# Altium schematic sheet remora-2-sensors.SchDoc
size Legal
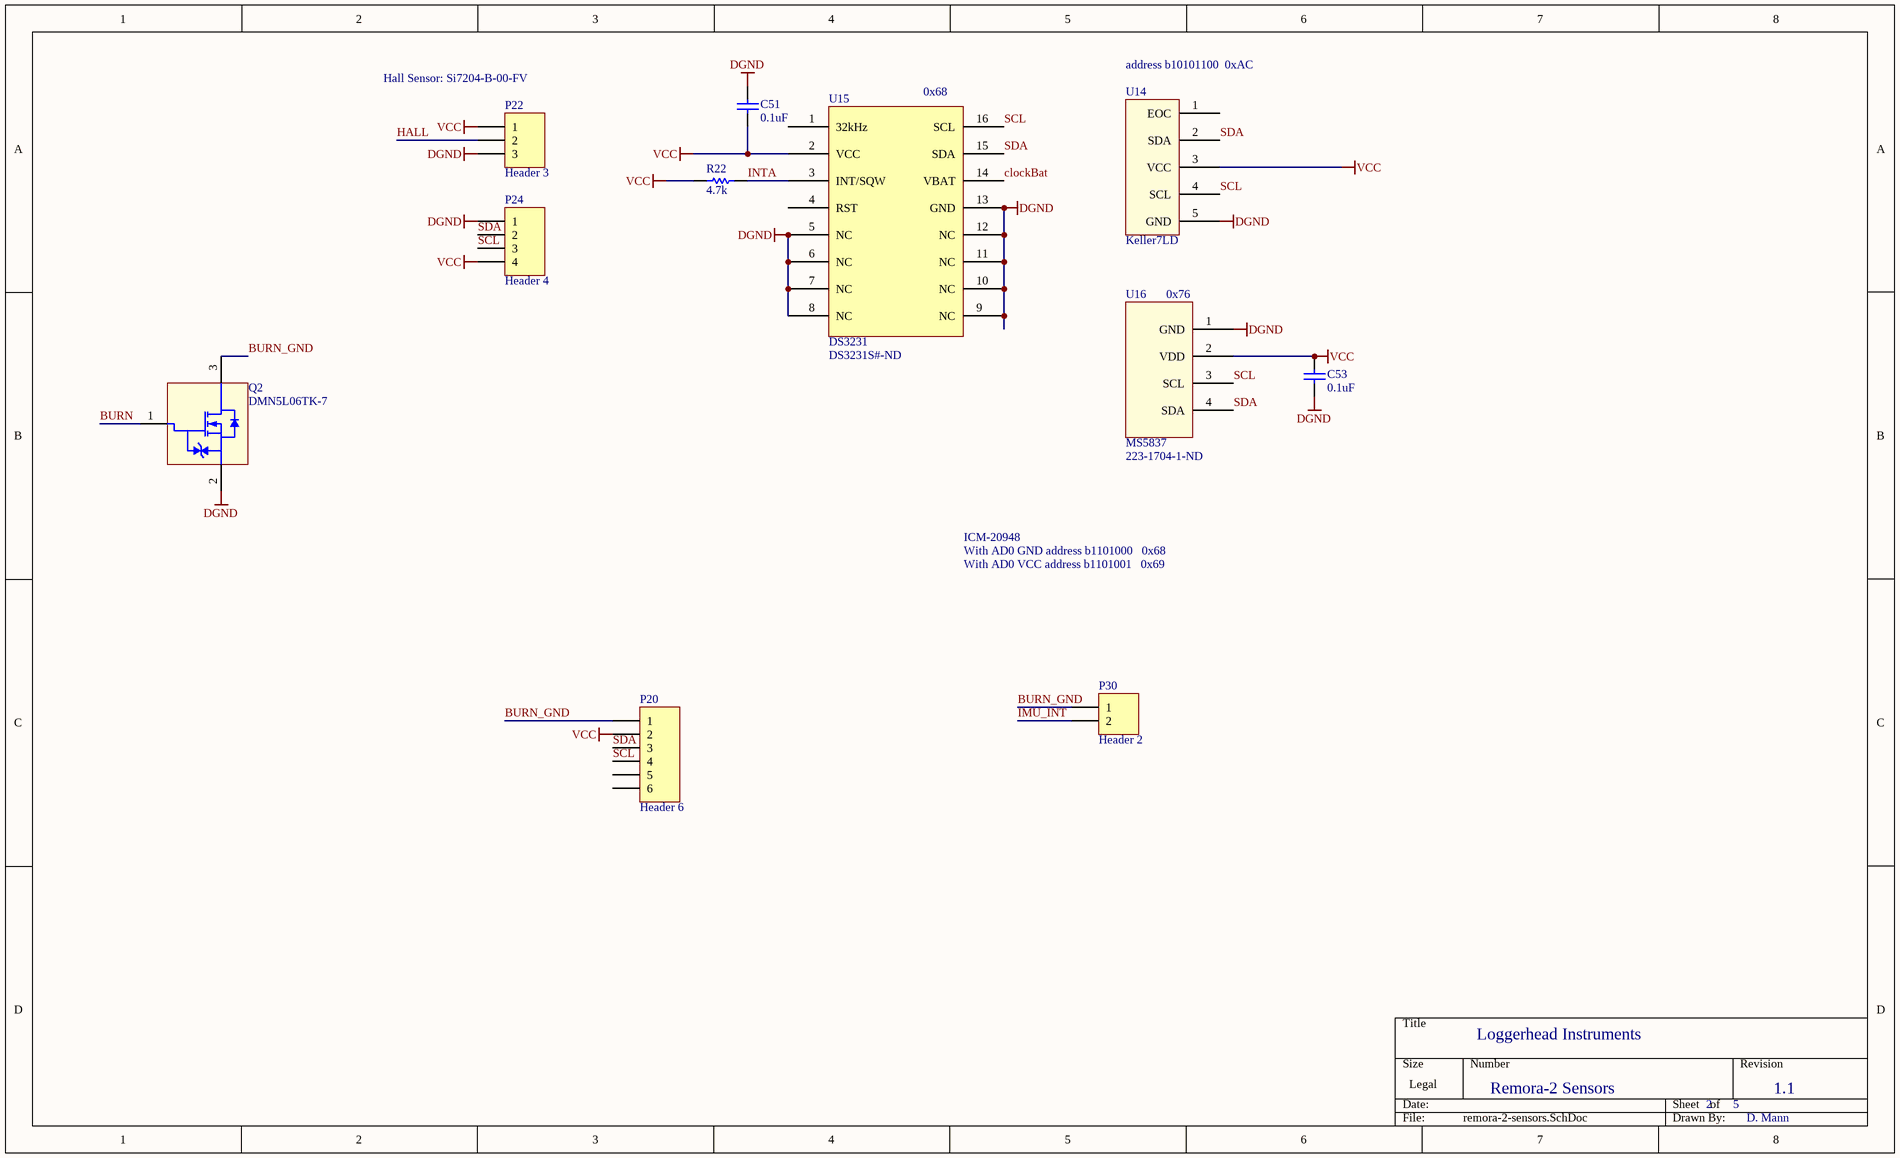
[diagram p0: remora-2-sensors.SchDoc]

## Parts
C51  0.1uF  [0402]
C53  0.1uF  [0402]
P20  Header 6  [HDR1X6]
P22  Header 3  [HDR1X3]
P24  Header 4  [HDR1X4]
P30  Header 2  [HDR1X2]
Q2  DMN5L06TK-7  [SOT-523]
R22  4.7k  [3-0603]
U14  Keller7LD  [Keller7LD]
U15  DS3231  Supplier Part Number 1: DS3231S#-ND  [DS3231]
U16  MS5837  Supplier Part Number 1: 223-1704-1-ND  [MS5837]

## Nets
DGND: C51.1 C53.1 P22.3 P24.1 Q2.2(S) U14.5(GND) U15.5(NC) U15.6(NC) U15.7(NC) U15.8(NC) U15.9(NC) U15.10(NC) U15.11(NC) U15.12(NC) U15.13(GND) U16.1(GND)
VCC: C51.2 C53.2 P20.2 P22.1 P24.4 R22.1 U14.3(VCC) U15.2(VCC) U16.2(VDD)
BURN: Q2.1(G)
BURN_GND: P20.1 P30.1 Q2.3(D)
clockBat: U15.14(VBAT)
HALL: P22.2
IMU_INT: P30.2
INTA: R22.2 U15.3(INT/SQW)
SCL: P20.4 P24.3 U14.4(SCL) U15.16(SCL) U16.3(SCL)
SDA: P20.3 P24.2 U14.2(SDA) U15.15(SDA) U16.4(SDA)

Not connected (* = marked no-connect by the designer): P20 5 6; U14 1(EOC); U15 1(32kHz) 4(RST)

## Notes on the sheet
- (near P22) Hall Sensor: Si7204-B-00-FV
- (near U15) 0x68
- (near U14) address b10101100  0xAC
- (near U16) 0x76
- With AD0 GND address b1101000   0x68
- With AD0 VCC address b1101001   0x69
- ICM-20948
- Loggerhead Instruments
- Remora-2 Sensors
- 2
- 5
- 1.1
- D. Mann

## Library data of the parts
C51 = C0402: Ceramic Chip Capacitor - Standard; Note: Footprint corresponds to dimensions for bulk cassette packaging. This case size has tightened tolerances.; Value: 10nF; Published: 17-Jul-2002; LatestRevisionDate: 19-Mar-2004; LatestRevisionNote: Silkscreen size reduced.; DatasheetDocument: Mar-2001; PackageDocument: Mar-2001; PackageReference: 0402; Publisher: Altium Limited; Code_JEITA: 0402; Code_IPC: 1005 [0402]; ComponentLink1Description: Manufacturer Link; ComponentLink1URL: http://www.kemet.com/; ComponentLink2Description: Datasheet; ComponentLink2URL: http://www.kemet.com/kemet/web/homepage/kechome.nsf/vapubfilesname/F3102TA.pdf/$file/F3102TA.pdf
C53 = C0402: Ceramic Chip Capacitor - Standard; Note: Footprint corresponds to dimensions for bulk cassette packaging. This case size has tightened tolerances.; Published: 17-Jul-2002; LatestRevisionDate: 19-Mar-2004; LatestRevisionNote: Silkscreen size reduced.; DatasheetDocument: Mar-2001; PackageDocument: Mar-2001; PackageReference: 0402; Publisher: Altium Limited; Code_JEITA: 0402; Code_IPC: 1005 [0402]; ComponentLink1Description: Manufacturer Link; ComponentLink1URL: http://www.kemet.com/; ComponentLink2Description: Datasheet; ComponentLink2URL: http://www.kemet.com/kemet/web/homepage/kechome.nsf/vapubfilesname/F3102TA.pdf/$file/F3102TA.pdf; Value: 0.1uF
P20 = Header 6: Header, 6-Pin; LatestRevisionDate: 17-Jul-2002; LatestRevisionNote: Re-released for DXP Platform.; Publisher: Altium Limited
P22 = Header 3: Header, 3-Pin; LatestRevisionDate: 17-Jul-2002; LatestRevisionNote: Re-released for DXP Platform.; Publisher: Altium Limited
P24 = Header 4: Header, 4-Pin; LatestRevisionDate: 17-Jul-2002; LatestRevisionNote: Re-released for DXP Platform.; Publisher: Altium Limited
P30 = Header 2: Header, 2-Pin; LatestRevisionDate: 17-Jul-2002; LatestRevisionNote: Re-released for DXP Platform.; Publisher: Altium Limited
Q2 = FET DMN5L06TK-7: Ultra-low leakage Enhanced MOSFET; Fabrication Tested: NO; Creator and Date: Will Flanery 2010-09-02; Footprint Verified By: *; Schematic Verified By: *; Vendor Info Verified By: *; Supplier 1: Digi-Key; Supplier Part Number 1: DMN5L06TKDICT-ND; HelpURL: http://www.diodes.com/datasheets/ds30926.pdf
R22 = ERJ3RK: Precision Thick Film Chip Resistor, 10 Ohm to 1M Ohm Range, 1% and 0.5% Tolerance, 0603 Size, 0.063 W; Published: 17-Dec-2003; LatestRevisionDate: 19-Mar-2004; LatestRevisionNote: Silkscreen size reduced.; PackageDocument: Mar-2003; PackageReference: 3-0603; Publisher: Altium Limited; Code_IPC: 1608 [0603]; ComponentLink1Description: Manufacturer Link; ComponentLink1URL: http://www.panasonic.com/industrial/components/resistive_products.htm; ComponentLink2Description: Datasheet; ComponentLink2URL: http://www.panasonic.com/industrial/components/pdf/AOA0000CE2.pdf
U14 = Keller 7LD: Keller Pressure/Temp; PDF: http://www.kelleramerica.com/pdf-library/Piezoresistive%20OEM%20Pressure%20Transmitters%20with%20I2C%20interface%20and%20embedded%20signal%20conditioning.pdf
U16 = MS5837: Pressure/Temp; Supplier 1: Digi-Key
U15 = DS3231: Supplier 1: Digi-Key